# EAGLE design SLC_Free_2_June_29_2017 (EAGLE 6.2)
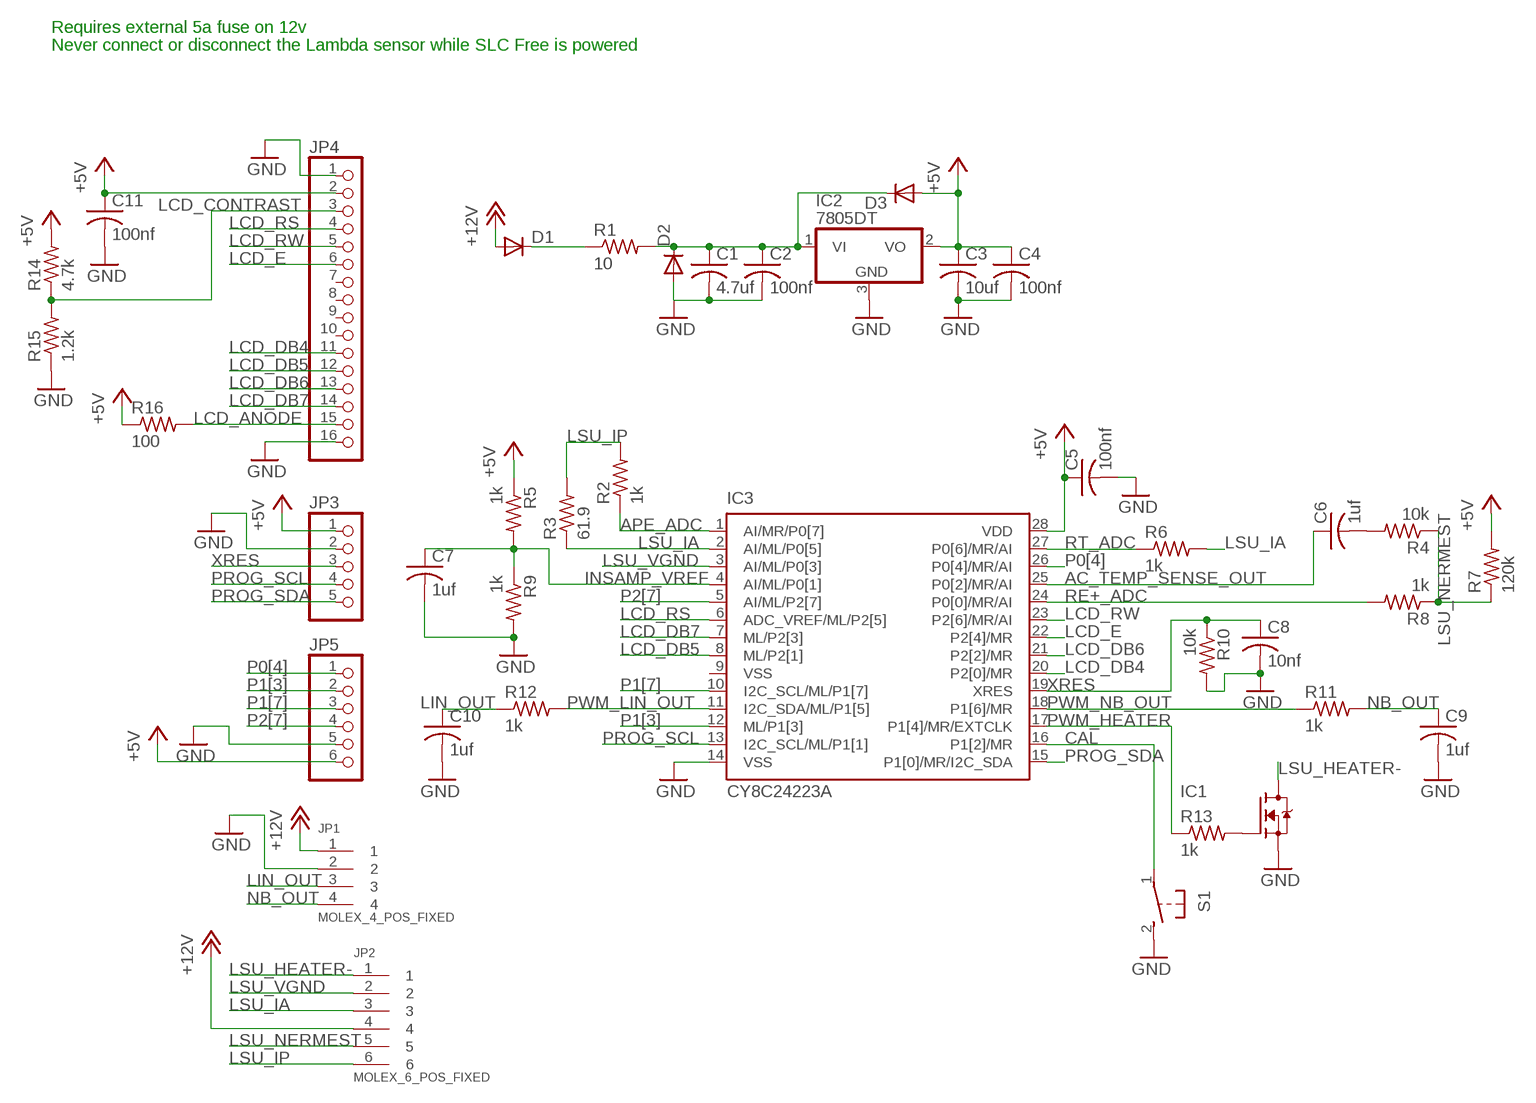
[diagram p0: schematic, sheet 1]

## Parts
C1  4.7uf  C-USC1210  [C1210]
C2  100nf  C-USC0805  [C0805]
C3  10uf  C-USC1206  [C1206]
C4  100nf  C-USC0805  [C0805]
C5  100nf  C-USC0805  [C0805]
C6  1uf  C-USC0805  [C0805]
C7  1uf  C-USC0805  [C0805]
C8  10nf  C-USC0805  [C0805]
C9  1uf  C-USC0805  [C0805]
C10  1uf  C-USC0805  [C0805]
C11  100nf  C-USC0805  [C0805]
D1  DIODE-SMB  [SMB]
D2  DIODE-SMB  [SMB]
D3  DIODE-SOD123  [SOD123]
IC1  FET_NMOS_T0252  [T0252]
IC2  7805DT  [TO252]
IC3  CY8C24223A  [SSOP28]
JP1  MOLEX_4_POS_FIXED  [MOLEX_4_POS_FIXED]
JP2  MOLEX_6_POS_FIXED  [MOLEX_6_POS_FIXED]
JP3  PINHD-1X5  [1X05]
JP4  PINHD-1X16  [1X16]
JP5  PINHD-1X6  [1X06]
R1  10  R-US_R1206  [R1206]
R2  1k  R-US_R0805  [R0805]
R3  61.9  R-US_R0805  [R0805]
R4  10k  R-US_R0805  [R0805]
R5  1k  R-US_R0805  [R0805]
R6  1k  R-US_R0805  [R0805]
R7  120k  R-US_R0805  [R0805]
R8  1k  R-US_R0805  [R0805]
R9  1k  R-US_R0805  [R0805]
R10  10k  R-US_R0805  [R0805]
R11  1k  R-US_R0805  [R0805]
R12  1k  R-US_R0805  [R0805]
R13  1k  R-US_R0805  [R0805]
R14  4.7k  R-US_R0805  [R0805]
R15  1.2k  R-US_R0805  [R0805]
R16  100  R-US_R1206  [R1206]
S1  31-XX  [B3F-31XX]

## Nets
+5V: C3.1 C4.1 C5.1 C11.1 D3.A IC2.2(VO) IC3.28(VDD) JP3.1 JP4.2 JP5.6 R5.1 R7.2 R14.2 R16.1
+12V: D1.A JP1.1 JP2.4
AC_TEMP_SENSE_OUT: C6.1 IC3.25(P0[2]/MR/AI)
APE_ADC: IC3.1(AI/MR/P0[7]) R2.1
CAL: IC3.16(P1[2]/MR) S1.1(P)
GND: C1.2 C2.2 C3.2 C4.2 C5.2 C7.2 C8.2 C9.2 C10.2 C11.2 D2.A IC1.2(S) IC2.3(GND) IC3.14(VSS) JP1.2 JP3.2 JP4.1 JP4.16 JP5.5 R9.2 R10.2 R15.1 S1.2(S)
INSAMP_VREF: C7.1 IC3.4(AI/ML/P0[1]) R5.2 R9.1
LCD_ANODE: JP4.15 R16.2
LCD_CONTRAST: JP4.3 R14.1 R15.2
LCD_DB4: IC3.20(P2[0]/MR) JP4.11
LCD_DB5: IC3.8(ML/P2[1]) JP4.12
LCD_DB6: IC3.21(P2[2]/MR) JP4.13
LCD_DB7: IC3.7(ML/P2[3]) JP4.14
LCD_E: IC3.22(P2[4]/MR) JP4.6
LCD_RS: IC3.6(ADC_VREF/ML/P2[5]) JP4.4
LCD_RW: IC3.23(P2[6]/MR/AI) JP4.5
LIN_OUT: C10.1 JP1.3 R12.1
LSU_HEATER-: IC1.3(D) JP2.1
LSU_IA: IC3.2(AI/ML/P0[5]) JP2.3 R3.1 R6.2
LSU_IP: JP2.6 R2.2 R3.2
LSU_NERMEST: JP2.5 R4.1 R7.1 R8.1
LSU_VGND: IC3.3(AI/ML/P0[3]) JP2.2
N$1: C6.2 R4.2
N$2: C1.1 C2.1 D2.C D3.C IC2.1(VI) R1.2
N$3: IC1.1(G) R13.2
N$5: D1.C R1.1
NB_OUT: C9.1 JP1.4 R11.2
P0[4]: IC3.26(P0[4]/MR/AI) JP5.1
P1[3]: IC3.12(ML/P1[3]) JP5.2
P1[7]: IC3.10(I2C_SCL/ML/P1[7]) JP5.3
P2[7]: IC3.5(AI/ML/P2[7]) JP5.4
PROG_SCL: IC3.13(I2C_SCL/ML/P1[1]) JP3.4
PROG_SDA: IC3.15(P1[0]/MR/I2C_SDA) JP3.5
PWM_HEATER: IC3.17(P1[4]/MR/EXTCLK) R13.1
PWM_LIN_OUT: IC3.11(I2C_SDA/ML/P1[5]) R12.2
PWM_NB_OUT: IC3.18(P1[6]/MR) R11.1
RE+_ADC: IC3.24(P0[0]/MR/AI) R8.2
RT_ADC: IC3.27(P0[6]/MR/AI) R6.1
XRES: C8.1 IC3.19(XRES) JP3.3 R10.1
Unconnected: JP4.7 JP4.8 JP4.9 JP4.10

## Notes on the sheet
- Requires external 5a fuse on 12v
- Never connect or disconnect the Lambda sensor while SLC Free is powered

## Power pins joined to a net without a drawn wire
VSS: IC3.9(VSS)

## Library data of the parts
C1-C11 = rcl:C-US: CAPACITOR, American symbol
D1-D3 = diode:DIODE-: DIODE
IC1 = FET_T252:FET_NMOS_T0252
IC2 = linear:78*: Positive VOLTAGE REGULATOR Source: http://cache.national.com/ds/LM/LM78L05.pdf http://www.fairchildsemi.com/ds/LM/LM7805.pdf
IC3 = Cy8C24223A:CY8C24223A
JP1 = molex_20:MOLEX_4_POS_FIXED
JP2 = molex_20:MOLEX_6_POS_FIXED
JP3 = pinhead:PINHD-1X5: PIN HEADER
JP4 = pinhead:PINHD-1X16: PIN HEADER
JP5 = pinhead:PINHD-1X6: PIN HEADER
R1-R16 = rcl:R-US_: RESISTOR, American symbol
S1 = switch-omron:31-XX: OMRON SWITCH; MPN: B3F-3100; OC_FARNELL: 959704; OC_NEWARK: 36M3582

## Board
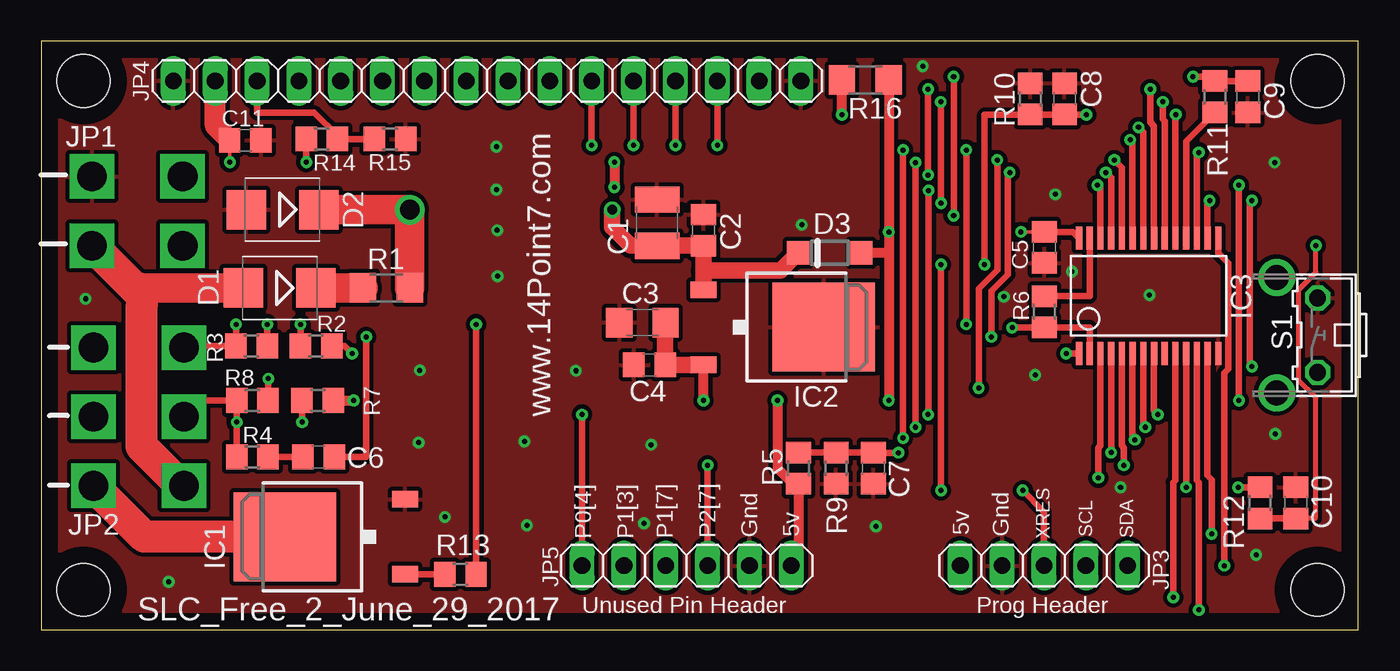
[diagram p1: board, top side]
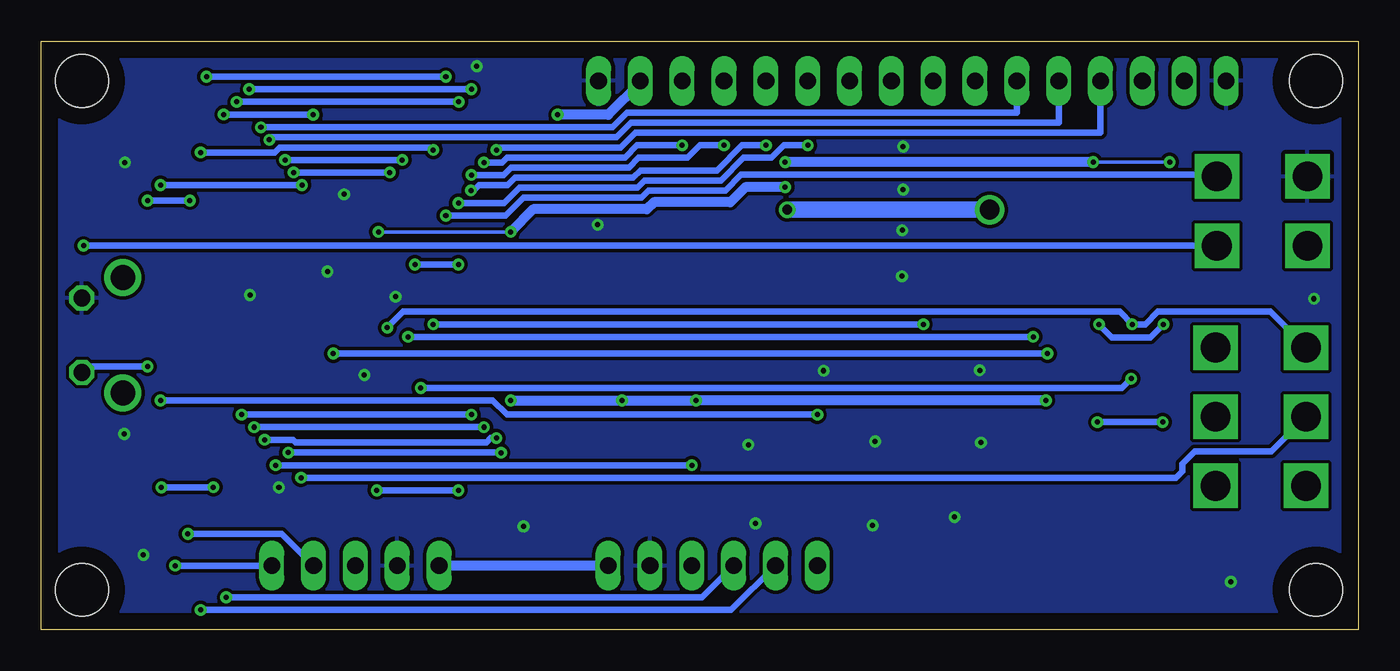
[diagram p2: board, bottom side, seen from below]

Size 79.96 x 35.74 mm. Coordinates in mm from the lower left corner, seen from the top.
Outline: 0,0 79.96,0 79.96,35.74 0,35.74 0,0
Copper layers (1*16): Top 0.035mm / dielectric 1.5mm / Bottom 0.035mm
Design rules: minimum track width 8mil, minimum drill 12mil, track to track 8mil, track to pad 8mil, pad to pad 8mil, via to via 8mil, smd to smd 8mil, copper to edge 40mil, drill to drill 8mil, minimum pad ring 10mil, minimum via ring 8mil, stop-mask expansion 2mil, vias tented up to drill 100mil, thermal gap 10mil
Holes 3.2 mm at 2.57,2.41 77.5,2.41 77.5,33.32 2.57,33.32

### Footprints (pad centres in the part's own frame; a part is rotated, then mirrored left to right if it is on the bottom)
C1210 = smd 1.6 x 2.7: 1 -1.4,0; 2 1.4,0
C0805 = smd 1.3 x 1.5: 1 -0.95,0; 2 0.95,0
C1206 = smd 1.6 x 1.8: 1 -1.4,0; 2 1.4,0
SMB = smd 2.4 x 2.4: A 2.2,0; C -2.2,0
SOD123 = smd 1.4 x 1.4: A 1.9,0; C -1.9,0
T0252 = smd 1 x 1.6: 1 -2.28,-6.07; 2 2.28,-6.07 | smd 5.4 x 6.2: 3 0,1.23
TO252 = smd 1 x 1.6: 1 -2.28,-4.8; 2 2.28,-4.8 | smd 5.4 x 6.2: 3 0,2.5
SSOP28 = smd 0.38 x 1.4: 1 -4.225,-3.5; 2 -3.575,-3.5; 3 -2.925,-3.5; 4 -2.275,-3.5; 5 -1.625,-3.5; 6 -0.975,-3.5; 7 -0.325,-3.5; 8 0.325,-3.5; 9 0.975,-3.5; 10 1.625,-3.5; 11 2.275,-3.5; 12 2.925,-3.5; 13 3.575,-3.5; 14 4.225,-3.5; 15 4.225,3.5; 16 3.575,3.5; 17 2.925,3.5; 18 2.275,3.5; 19 1.625,3.5; 20 0.975,3.5; 21 0.325,3.5; 22 -0.325,3.5; 23 -0.975,3.5; 24 -1.625,3.5; 25 -2.275,3.5; 26 -2.925,3.5; 27 -3.575,3.5; 28 -4.225,3.5
MOLEX_4_POS_FIXED = drill 1.8 square: 1 -2.081,2.778; 2 2.119,2.778; 3 -2.081,-2.722; 4 2.119,-2.722
MOLEX_6_POS_FIXED = drill 1.8 square: 1 -4.3,2.93; 2 -0.1,2.93; 3 4.1,2.93; 4 -4.3,-2.57; 5 -0.1,-2.57; 6 4.1,-2.57
1X05 = drill 1.016 long: 1 -5.08,0; 2 -2.54,0; 3 0,0; 4 2.54,0; 5 5.08,0
1X16 = drill 1.016 long: 1 -19.05,0; 2 -16.51,0; 3 -13.97,0; 4 -11.43,0; 5 -8.89,0; 6 -6.35,0; 7 -3.81,0; 8 -1.27,0; 9 1.27,0; 10 3.81,0; 11 6.35,0; 12 8.89,0; 13 11.43,0; 14 13.97,0; 15 16.51,0; 16 19.05,0
1X06 = drill 1.016 long: 1 -6.35,0; 2 -3.81,0; 3 -1.27,0; 4 1.27,0; 5 3.81,0; 6 6.35,0
R1206 = smd 1.6 x 1.803: 1 -1.422,0; 2 1.422,0
R0805 = smd 1.3 x 1.5: 1 -0.95,0; 2 0.95,0
B3F-31XX = drill 1.016 octagon: 1 -2.261,-1.245; 2 2.261,-1.245 | drill 1.499 pad 2.159: 3 -3.505,1.245; 4 3.505,1.245

### Placement (x,y rotation side)
C1  37.39,24.71 90 top
C2  40.21,24.26 90 top
C3  36.5,18.64 180 top
C4  36.93,16.08 180 top
C5  60.91,23.22 270 top
C6  16.84,10.49 180 top
C7  50.52,9.8 270 top
C8  62.13,32.23 90 top
C9  73.25,32.36 270 top
C10  76.17,7.7 90 top
C11  12.4,29.72 0 top
D1  14.48,20.75 180 top
D2  14.66,25.5 180 top
D3  47.88,22.89 0 top
IC1  16.03,5.64 90 top
IC2  45.01,18.36 270 top
IC3  67.23,20.27 0 top
JP1  5.87,25.4 90 top
JP2  6.1,13.03 90 top
JP3  60.88,3.89 0 top
JP4  27.08,33.32 0 top
JP5  39.19,3.89 0 top
R1  20.95,20.75 0 top
R2  16.69,17.22 180 top
R3  12.78,17.22 180 top
R4  12.83,10.49 0 top
R5  45.97,9.8 90 top
R6  60.91,19.3 270 top
R7  16.79,13.92 0 top
R8  12.83,13.92 0 top
R9  48.26,9.8 270 top
R10  60.05,32.23 90 top
R11  71.25,32.36 90 top
R12  73.99,7.7 90 top
R13  25.45,3.35 180 top
R14  17.04,29.79 180 top
R15  21.18,29.79 180 top
R16  50.04,33.38 180 top
S1  76.25,17.88 90 top

### Tracks (layer width: path | path; a pad name or v marks a point on that pad's centre or on a via)
+5V  (via drill 0.3, 0.3 pad 0.61)
  Top 0.203: C5.1 61.41,24.15 v59.49,24.15 | v11.46,28.4 C11.1
  Top 0.406: C11.1 11.45,29.91 | v16.09,28.4 R14.2 | 61.41,24.15 62.62,24.15 IC3.28
  Top 0.61: v44.7,13.92 44.7,9.8 45.65,8.85 R5.1 45.97,4.32 JP5.6 | R16.1 v51.46,24.15 51.46,22.89 | R7.2 v18.97,13.92 | 51.46,22.89 v51.46,13.92 | D3.A 51.46,22.89 | IC2.2 | v40.21,13.92 IC2.2 | IC2.2 | v34.8,28.4 v34.8,26.87
  Top 1.016: IC2.2 C4.1 37.88,18.4 C3.1
  Top 1.27: C11.1 10.57,30.6 JP4.2
  Bottom 0.203: v59.49,24.15 v51.46,24.15 | v16.09,28.4 v11.46,28.4
  Bottom 0.61: v18.97,13.92 v40.21,13.92 v44.7,13.92 v51.46,13.92 | v16.09,28.4 v34.8,28.4 | v34.8,26.87 37.21,26.87 38.13,25.96 42.77,25.96 43.21,25.53 50.09,25.53 v51.46,24.15 | JP5.6 JP3.1
+12V
  Top 1.422: 6.1,19.58 6.1,20.74 6.07,20.77
  Top 1.778: D1.A 6.09,20.75 6.07,20.77
  Top 1.93: JP2.4 8.49,8.73 6.1,11.12 6.1,19.58 6.1,20.31 JP1.1
AC_TEMP_SENSE_OUT  (via drill 0.3)
  Top 0.406: IC3.25 64.96,27.45 v64.64,27.76 | C6.1 19.74,10.49 v19.74,17.78 | v57.68,17.78 57.68,20.55 58.7,21.57 58.7,27.66 v58.8,27.76
  Bottom 0.406: v19.74,17.78 v57.68,17.78 | v58.8,27.76 v64.64,27.76
APE_ADC  (via drill 0.3)
  Top 0.406: IC3.1 v62.24,16.77 v62.23,16.76 | v18.87,16.76 18.41,17.22 R2.1
  Bottom 0.406: v62.23,16.76 v18.87,16.76
CAL  (via drill 0.3)
  Top 0.406: IC3.16 70.81,25.93 v70.94,26.06 | v73.51,15.98 73.38,16.1 73.38,25.93 v73.51,26.06
  Bottom 0.406: v70.94,26.06 v73.51,26.06 | v73.51,15.98 77.14,15.98 S1.1
GND  (via drill 0.3)
  other vias: 27.64,26.72 27.71,21.46 22.91,11.35 7.75,2.9 29.34,11.43 29.49,6.32 27.64,29.34 37.03,11.23 36.6,6.45 50.67,6.27 65.53,8.64 73.76,4.55 74.93,11.89 67.28,20.32 60.35,15.47 61.57,26.44 74.88,28.37 53.52,34.21 2.69,20.09 22.99,15.75 46.18,24.59 58.45,20.22 62.59,21.74 27.69,24.26 32.46,15.72 24.51,6.83
  pour Bottom: -6.96,38.07 83.29,38.33 83.03,-13.51 -7.21,-13.77
  pour Top (isolate 0.254): -6.22,38.61 84.56,38.61 84.56,-5.84 -6.22,-5.84
INSAMP_VREF  (via drill 0.3)
  Top 0.406: R5.2 R9.1 C7.1 50.53,10.74 v52.04,10.74 | IC3.4 v64.96,10.75
  Bottom 0.406: v64.96,10.75 v52.05,10.75 v52.04,10.74
LCD_ANODE  (via drill 0.3)
  Top 0.61: v48.62,31.27 R16.2
  Bottom 0.61: JP4.15 43.59,33.22 45.54,31.27 v48.62,31.27
LCD_CONTRAST
  Top 0.406: R15.2 R14.1 17.99,29.99 16.59,31.39 13.11,31.39 JP4.3
LCD_DB4  (via drill 0.3, 0.3 pad 0.61)
  Top 0.406: JP4.11 v33.43,29.41 | IC3.20 68.21,30.88 68.1,30.99 v68.1,32.05 | v54.64,25.91 54.64,32.03 v54.61,32.05
  Bottom 0.406: v68.1,32.05 v54.61,32.05 | v54.64,25.91 51.87,25.91 50.93,26.85 43.76,26.85 43.33,27.28 38.68,27.28 37.31,28.65 35.64,28.65 34.87,29.41 v33.43,29.41
LCD_DB5  (via drill 0.3, 0.3 pad 0.61)
  Top 0.406: JP4.12 v35.97,29.41 | IC3.8 67.56,13.29 v67.79,13.06 | v53.87,26.67 53.87,13.08 v53.85,13.06
  Bottom 0.406: v67.79,13.06 v53.85,13.06 | v53.87,26.67 53.72,26.67 53.39,27 51.64,27 51.18,27.46 44.02,27.46 43.59,27.89 38.94,27.89 37.41,29.41 v35.97,29.41
LCD_DB6  (via drill 0.3, 0.3 pad 0.61)
  Top 0.406: JP4.13 v38.51,29.41 | IC3.21 67.56,30.59 67.34,30.81 v67.34,32.82 | v53.85,27.61 v53.85,32.82
  Bottom 0.406: v53.85,27.61 51.89,27.61 51.43,28.07 44.27,28.07 43.69,28.65 40.72,28.65 39.95,29.41 v38.51,29.41 | v53.85,32.82 v67.34,32.82
LCD_DB7  (via drill 0.3, 0.3 pad 0.61)
  Top 0.406: JP4.14 v41.05,29.41 | v53.09,28.37 v53.09,12.29 | IC3.7 66.91,12.42 v67.04,12.29
  Bottom 0.406: v41.05,29.41 43.79,29.41 44.53,28.68 51.69,28.68 51.99,28.37 v53.09,28.37 | v67.04,12.29 v53.09,12.29
LCD_E  (via drill 0.3)
  Top 0.406: IC3.22 66.91,30.22 v66.62,30.5
  Bottom 0.406: JP4.6 20.73,31.39 44.4,31.39 45.29,30.5 v66.62,30.5
LCD_RS  (via drill 0.3 pad 0.61)
  Top 0.406: v52.32,29.13 v52.32,11.63 | IC3.6 66.26,11.64 v66.4,11.53
  Bottom 0.406: JP4.4 15.65,30.18 43.89,30.18 44.78,29.29 52.17,29.29 v52.32,29.13 | v52.32,11.63 52.68,11.63 52.93,11.38 64.52,11.38 64.67,11.53 v66.4,11.53
LCD_RW  (via drill 0.3)
  Top 0.406: IC3.23 66.26,29.6 v66.12,29.74
  Bottom 0.406: JP4.5 18.19,30.79 44.15,30.79 45.03,29.9 65.96,29.9 v66.12,29.74
LIN_OUT  (via drill 0.3)
  Top 0.305: C10.1 77.34,6.75 77.34,14.15 76.33,15.16 76.33,20.62 77.39,21.69 v77.39,23.32
  Top 0.406: C10.1 R12.1
  Bottom 0.406: JP1.3 v77.39,23.32
LSU_HEATER-
  Top 1.93: IC1.3 6.26,5.64 JP2.1
LSU_IA  (via drill 0.3)
  Top 0.406: R3.1 v13.73,18.54 | v58.95,18.34 61.43,18.34 R6.2 63.66,18.35 IC3.2
  Bottom 0.406: JP2.3 5.34,19.3 12.17,19.3 12.93,18.54 v13.73,18.54 14.49,19.3 57.99,19.3 v58.95,18.34
LSU_IP  (via drill 0.3)
  Top 0.406: v11.83,18.54 R3.2 8.76,17.22 JP2.6 | v15.74,18.54 R2.2
  Bottom 0.406: v11.83,18.54 12.61,17.75 14.95,17.75 v15.74,18.54
LSU_NERMEST  (via drill 0.3)
  Top 0.406: R7.1 v15.84,12.6 | R4.1 v11.88,12.6 R8.1 9.65,13.92 JP2.5
  Bottom 0.406: v15.84,12.6 v11.88,12.6
LSU_VGND  (via drill 0.3)
  Top 0.406: IC3.3 64.31,11.17 64.19,11.05 v64.19,9.22
  Bottom 0.406: v64.19,9.22 11.07,9.22 10.69,9.6 10.69,10.06 9.93,10.82 5.28,10.82 JP2.2
N$1
  Top 0.406: R4.2 C6.2
N$2  (via drill 0.6, 1.2)
  Top 1.016: D3.C 44.89,21.79 40.21,21.79 | 40.21,21.79 IC2.1 | 40.21,21.79 C2.1 C1.1 35.79,23.32 34.67,24.43 v34.67,25.5
  Top 1.778: R1.2 v22.38,25.5 D2.C
  Bottom 1.016: v22.38,25.5 v34.67,25.5
N$3
  Top 0.406: IC1.1 24.49,3.36 R13.2
N$5
  Top 1.778: D1.C R1.1
NB_OUT  (via drill 0.3 pad 0.61)
  Top 0.406: C9.1 R11.2 70.98,33.58 v69.93,33.58 | v55.4,25.15 v55.4,33.58
  Bottom 0.406: v55.4,33.58 v69.93,33.58 | JP1.4 8.71,27.64 37.46,27.64 38.43,26.67 43.08,26.67 43.51,26.24 50.67,26.24 51.77,25.15 v55.4,25.15
P0[4]  (via drill 0.3)
  Top 0.406: IC3.26 64.31,26.83 v64.13,27 | JP5.1 v32.84,13.06 | v72.72,13.92 v72.72,27
  Bottom 0.406: v32.84,13.06 51.69,13.06 52.55,13.92 v72.72,13.92 | v72.72,27 v64.13,27
P1[3]  (via drill 0.3 pad 0.61)
  Top 0.406: IC3.12 70.16,9.06 70.28,8.94 v70.28,1.19
  Bottom 0.406: v70.28,1.19 38.07,1.19 JP5.2
P1[7]  (via drill 0.3)
  Top 0.406: IC3.10 68.86,9.07 68.73,8.94 v68.73,1.96
  Bottom 0.406: v68.73,1.96 39.85,1.96 JP5.3
P2[7]  (via drill 0.3 pad 0.61)
  Top 0.406: IC3.5 65.61,11.18 65.74,11.05 v65.74,9.98 | v40.46,9.98 JP5.4
  Bottom 0.406: v65.74,9.98 v40.46,9.98
PROG_SCL  (via drill 0.3 pad 0.61)
  Top 0.406: IC3.13 70.81,9.35 71.06,9.1 v71.06,5.82
  Bottom 0.406: JP3.4 65.35,5.82 v71.06,5.82
PROG_SDA  (via drill 0.3 pad 0.61)
  Top 0.406: v71.83,3.89 71.83,15.6 72.06,15.82 72.06,22.28 71.46,22.88 IC3.15
  Bottom 0.406: JP3.5 v71.83,3.89
PWM_HEATER  (via drill 0.3)
  Top 0.406: IC3.17 70.16,28.85 v70.29,28.98 | v56.16,29.13 v56.16,18.54 | v26.4,18.54 R13.1
  Bottom 0.406: v70.29,28.98 65.79,28.98 65.48,29.29 56.31,29.29 v56.16,29.13 | v56.16,18.54 v26.4,18.54
PWM_LIN_OUT  (via drill 0.3)
  Top 0.406: IC3.11 v69.51,8.65 | v72.67,8.64 73.98,8.64 R12.2
  Bottom 0.406: v69.51,8.65 72.81,8.65 v72.67,8.64
PWM_NB_OUT
  Top 0.406: IC3.18 69.51,29.67 R11.1
RE+_ADC  (via drill 0.3)
  Top 0.406: IC3.24 65.61,28.07 v65.15,28.52 | R8.2 13.78,15.22 v13.79,15.24 | v56.92,14.68 56.92,20.73 58.04,21.84 v58.04,28.52
  Bottom 0.406: v13.79,15.24 14.35,14.68 v56.92,14.68 | v58.04,28.52 v65.15,28.52
RT_ADC
  Top 0.406: R6.1 63.66,20.25 IC3.27
XRES  (via drill 0.3)
  Top 0.406: v63.45,31.27 62.14,31.27 | 62.14,31.27 C8.1 | 62.14,31.27 60.06,31.27 | 60.06,31.27 R10.1 | IC3.19 68.86,31.26 v68.88,31.28 | v57.28,22.17 57.28,31.27 60.06,31.27 | v54.64,8.46 v54.64,22.17 | v59.59,8.46 60.88,7.16 JP3.3
  Bottom 0.406: v68.88,31.28 63.46,31.28 v63.45,31.27 | v59.59,8.46 v54.64,8.46 | v54.64,22.17 v57.28,22.17

### Text on the board
tNames: www.14Point7.com | SDA | Gnd | 5v | 5v | Gnd | SCL | P0[4] | P1[3] | P1[7] | P2[7] | XRES | Unused Pin Header | Prog Header | SLC_Free_2_June_29_2017